# Altium project PCB_Project1.PrjPCB
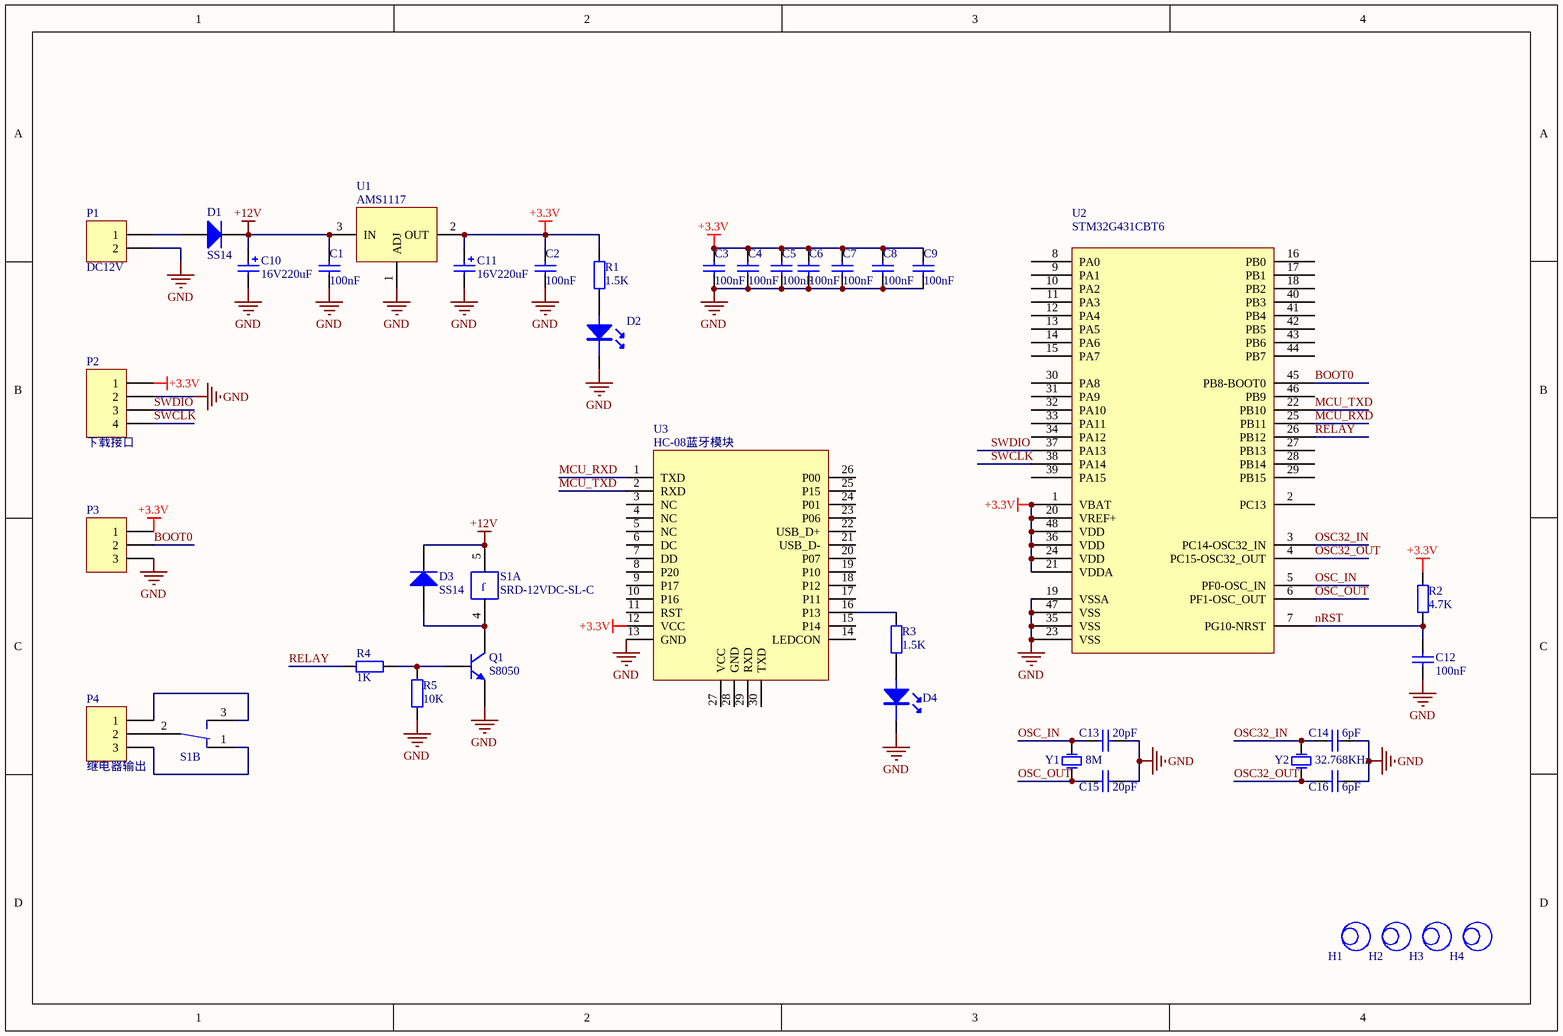
[diagram p0: Sheet1.SchDoc]
1 sheet, 40 parts. Net scope: global (net labels, ports and power ports of the same name join across sheets).
Board file: PCB1.PcbDoc

## Sheet Sheet1.SchDoc
size A4

### Parts
C1  100nF  [0603M]
C2  100nF  [0603M]
C3  100nF  [0603M]
C4  100nF  [0603M]
C5  100nF  [0603M]
C6  100nF  [0603M]
C7  100nF  [0603M]
C8  100nF  [0603M]
C9  100nF  [0603M]
C10  16V220uF  [CAP-6.3x7.7]
C11  16V220uF  [CAP-6.3x7.7]
C12  100nF  [0603M]
C13  20pF  [0603M]
C14  6pF  [0603M]
C15  20pF  [0603M]
C16  6pF  [0603M]
D1  SS14  [SMA]
D2  POWER  [LED-0805-R]  (value not drawn)
D3  SS14  [SMA]
D4  POWER  [LED-0805-G]  (value not drawn)
H1  非金属化固定孔  [HOLE-3MM]  (value not drawn)
H2  非金属化固定孔  [HOLE-3MM]  (value not drawn)
H3  非金属化固定孔  [HOLE-3MM]  (value not drawn)
H4  非金属化固定孔  [HOLE-3MM]  (value not drawn)
P1  DC12V  [CON-KF2EDGK-5.08-W-2P]
P2  下载接口  [HDR1X4]
P3  MHDR1X3  [HDR1X3]  (value not drawn)
P4  继电器输出  [CON-KF2EDGK-5.08-W-3P]
Q1  S8050  [SOT-23]
R1  1.5K  [0603M]
R2  4.7K  [0603M]
R3  1.5K  [0603M]
R4  1K  [0603M]
R5  10K  [0603M]
S1  SRD-12VDC-SL-C  [SRD-05VDC-SL-C]  (parts A,B of 2)
U1  AMS1117  [SOT-223-M]
U2  STM32G431CBT6  [LQFP48]
U3  HC-08蓝牙模块  [HC-02/04/08/08B/42]
Y1  8M  [X-49/S_N]
Y2  32.768KHz  [X-2X6]

### Nets
+3.3V: C2.2 C3.2 C4.2 C5.2 C6.2 C7.2 C8.2 C9.2 C11.1 P2.1 P3.1 R1.2 R2.2 U1.2(OUT) U2.1(VBAT) U2.20(VREF+) U2.21(VDDA) U2.24(VDD) U2.36(VDD) U2.48(VDD) U3.12(VCC)
+12V: C1.2 C10.1 D1.2(K) D3.2(K) S1.5(K2) U1.3(IN)
GND: C1.1 C2.1 C3.1 C4.1 C5.1 C6.1 C7.1 C8.1 C9.1 C10.2 C11.2 C12.1 C13.2 C14.2 C15.2 C16.2 D2.2(K) D4.2(K) P1.2 P2.2 P3.3 Q1.2(E) R5.2 U1.1(ADJ) U2.19(VSSA) U2.23(VSS) U2.35(VSS) U2.47(VSS) U3.13(GND)
BOOT0: P3.2 U2.45(PB8-BOOT0)
MCU_RXD: U2.25(PB11) U3.1(TXD)
MCU_TXD: U2.22(PB10) U3.2(RXD)
nRST: C12.2 R2.1 U2.7(PG10-NRST)
OSC32_IN: C14.1 U2.3(PC14-OSC32_IN) Y2.1
OSC32_OUT: C16.1 U2.4(PC15-OSC32_OUT) Y2.2
OSC_IN: C13.1 U2.5(PF0-OSC_IN) Y1.1
OSC_OUT: C15.1 U2.6(PF1-OSC_OUT) Y1.2
RELAY: R4.1 U2.26(PB12)
SWCLK: P2.4 U2.38(PA14)
SWDIO: P2.3 U2.37(PA13)
NetD1_1: D1.1(A) P1.1
NetD2_1: D2.1(A) R1.1
NetD3_1: D3.1(A) Q1.3(C) S1.4(K1)
NetD4_1: D4.1(A) R3.2
NetP4_1: P4.1 S1.3
NetP4_2: P4.2 S1.2
NetP4_3: P4.3 S1.1
NetQ1_1: Q1.1(B) R4.2 R5.1
NetR3_1: R3.1 U3.16(P13)

Not connected (* = marked no-connect by the designer): U2 2(PC13) 8(PA0) 9(PA1) 10(PA2) 11(PA3) 12(PA4) 13(PA5) 14(PA6) 15(PA7) 16(PB0) 17(PB1) 18(PB2) 27(PB13) 28(PB14) 29(PB15) 30(PA8) 31(PA9) 32(PA10) 33(PA11) 34(PA12) 39(PA15) 40(PB3) 41(PB4) 42(PB5) 43(PB6) 44(PB7) 46(PB9); U3 3(NC) 4(NC) 5(NC) 6(DC) 7(DD) 8(P20) 9(P17) 10(P16) 11(RST) 14(LEDCON) 15(P14) 17(P11) 18(P12) 19(P10) 20(P07) 21(USB_D-) 22(USB_D+) 23(P06) 24(P01) 25(P15) 26(P00) 27(VCC) 28(GND) 29(RXD) 30(TXD)

### Notes on the sheet
- (in symbol RELAY-SRD-05VDC-SL-C-SP, part A) J

### Library data of the parts
C1-C9 C12-C16 = Cap: 贴片电容
C10 C11 = ECAP: 电解电容; Published: 8-Jun-2000; LatestRevisionDate: 17-Jul-2002; LatestRevisionNote: Re-released for DXP Platform.; PackageReference: RB7.6-15; Publisher: Altium Limited; PackageDescription: Polarized Capacitor (Radial); 2 Leads
D1 D3 = Diode: 二极管; Published: 8-Jun-2000; LatestRevisionDate: 17-Jul-2002; LatestRevisionNote: Re-released for DXP Platform.; PackageVersion: Sep-1996; PackageReference: SMC; Publisher: Altium Limited; PackageDescription: DO-214-AB/SMC; 2 C-Bend Leads; Body 7.9 x 5.9 mm, inc. leads (LxW); Code_JEDEC: DO-214-AB
D2 D4 = LED1: 发光二极管; Value: 红色; 物料: *; 名称: *; 规格: *; 封装: *; 设备: *; RoHS: *; 贴?: *; 器件: *; ComponentLink1Description: *; ComponentLink1URL: *
H1-H4 = Hole-非金属化固定孔
P1 = MHDR1X2: Header, 2-Pin; LatestRevisionDate: 17-Jul-2002; LatestRevisionNote: Re-released for DXP Platform.; Publisher: Altium Limited
P2 = Header 4: Header, 4-Pin; LatestRevisionDate: 17-Jul-2002; LatestRevisionNote: Re-released for DXP Platform.; Publisher: Altium Limited
P3 P4 = MHDR1X3: Header, 3-Pin; LatestRevisionDate: 17-Jul-2002; LatestRevisionNote: Re-released for DXP Platform.; Publisher: Altium Limited
Q1 = Transistor-NPN
R1-R5 = 电阻: 贴片电阻
S1 = RELAY-SRD-05VDC-SL-C-SP: Relay
U1 = AMS1117: 线性稳压芯片
U3 = HC-08
Y1 Y2 = XTAL_1: 晶振（直插）; Value: 25MHz ±20ppm 20pF; Published: 8-Jun-2000; LatestRevisionDate: 17-Jul-2002; LatestRevisionNote: Re-released for DXP Platform.; PackageReference: R38; Publisher: Altium Limited